# EAGLE design infnoise_edgecon (EAGLE 7.1.0)
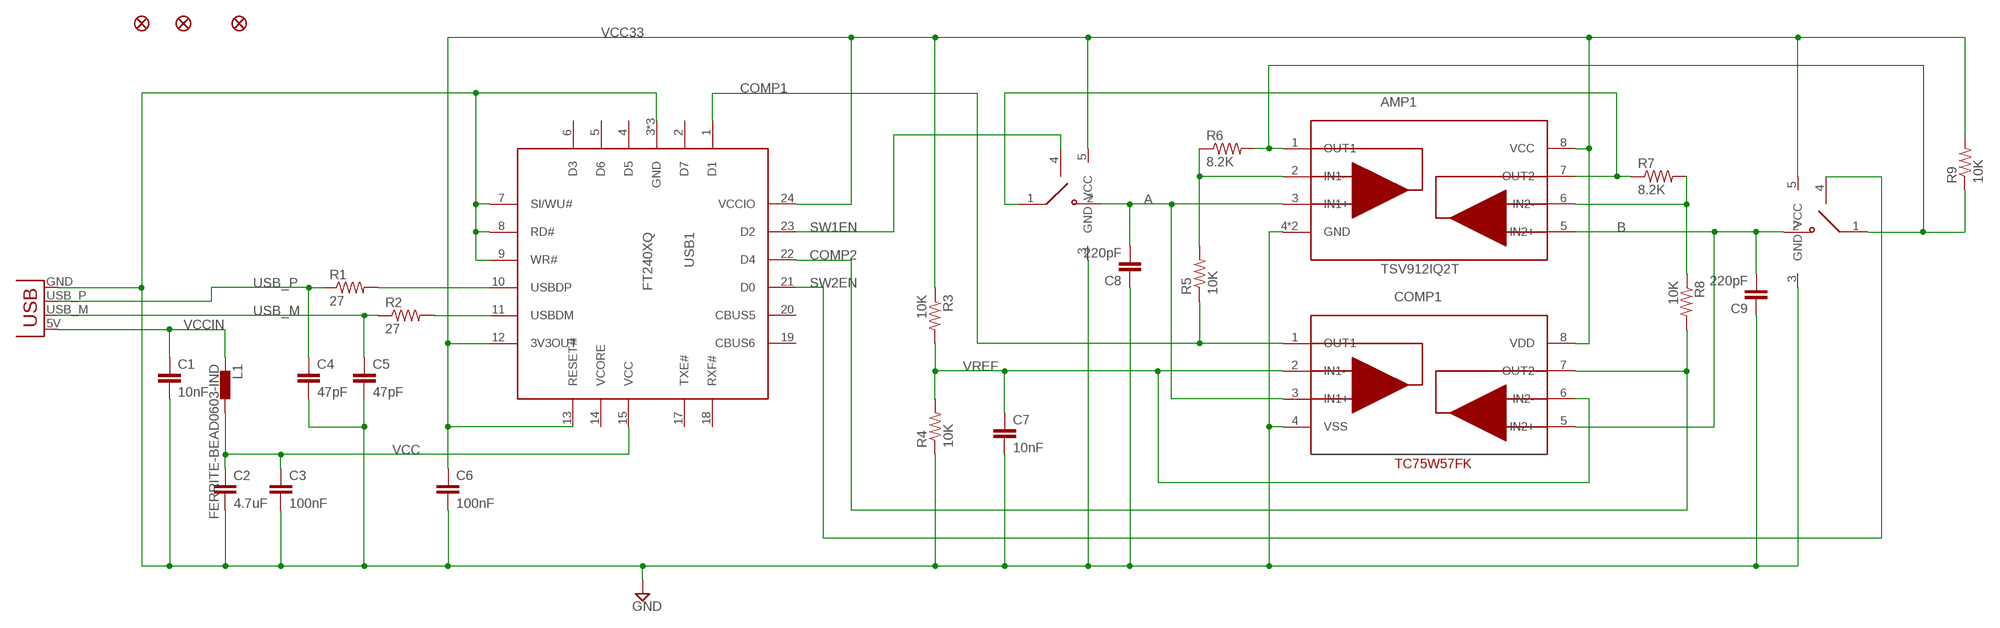
[diagram p0: schematic, sheet 1]

## Parts
AMP1  TSV912IQ2T  [DFN8-2X3]
C1  10nF  CAP0603-CAP  [0603-CAP]
C2  4.7uF  CAP0603-CAP  [0603-CAP]
C3  100nF  CAP0603-CAP  [0603-CAP]
C4  47pF  CAP0603-CAP  [0603-CAP]
C5  47pF  CAP0603-CAP  [0603-CAP]
C6  100nF  CAP0603-CAP  [0603-CAP]
C7  10nF  CAP0603-CAP  [0603-CAP]
C8  220pF  CAP0603-CAP  [0603-CAP]
C9  220pF  CAP0603-CAP  [0603-CAP]
COMP1  TC75W57FK  [SSOP8-P-0.50A]
FID1  FIDUCIALUFIDUCIAL  [MICRO-FIDUCIAL]
FID2  FIDUCIALUFIDUCIAL  [MICRO-FIDUCIAL]
FID3  FIDUCIALUFIDUCIAL  [MICRO-FIDUCIAL]
L1  FERRITE-BEAD0603-IND  [0603-IND]
R1  27  RESISTOR0603-RES  [0603-RES]
R2  27  RESISTOR0603-RES  [0603-RES]
R3  10K  RESISTOR0603-RES  [0603-RES]
R4  10K  RESISTOR0603-RES  [0603-RES]
R5  10K  RESISTOR0603-RES  [0603-RES]
R6  8.2K  RESISTOR0603-RES  [0603-RES]
R7  8.2K  RESISTOR0603-RES  [0603-RES]
R8  10K  RESISTOR0603-RES  [0603-RES]
R9  10K  RESISTOR0603-RES  [0603-RES]
SW1  MC74VHC1G66DFT1G  [SC70-5L]
SW2  MC74VHC1G66DFT1G  [SC70-5L]
USB1  FT240XQ  [QFN24-4X4]
X1  USB  [USB-A-PCB]

## Nets
A: AMP1.3(IN1+) C8.2 COMP1.3(IN1+) SW1.2(NO)
AMP1OUT: AMP1.1(OUT1) R6.2 R9.1 SW2.1(COM)
AMP2OUT: AMP1.7(OUT2) R7.1 SW1.1(COM)
B: AMP1.5(IN2+) C9.2 COMP1.5(IN2+) SW2.2(NO)
COMP1: COMP1.1(OUT1) R5.1 USB1.1(D1)
COMP2: COMP1.7(OUT2) R8.2 USB1.22(D4)
FB1: AMP1.2(IN1-) R5.2 R6.1
FB2: AMP1.6(IN2-) R7.2 R8.1
GND: AMP1.4(GND) AMP1.EXP(GND) C1.2 C2.2 C3.2 C4.2 C5.2 C6.2 C7.2 C8.1 C9.1 COMP1.4(VSS) R4.1 SW1.3(GND) SW2.3(GND) USB1.3(GND) USB1.7(SI/WU#) USB1.8(RD#) USB1.9(WR#) USB1.16(GND) USB1.EXP(GND) X1.GND
N$2: R1.2 USB1.10(USBDP)
SW1EN: SW1.4(IN) USB1.23(D2)
SW2EN: SW2.4(IN) USB1.21(D0)
USB_M: C5.1 R2.1 X1.USB_M(D-)
USB_P: C4.1 R1.1 X1.USB_P(D+)
USBDM: R2.2 USB1.11(USBDM)
VCC: C2.1 C3.1 L1.2 USB1.15(VCC)
VCC33: AMP1.8(VCC) C6.1 COMP1.8(VDD) R3.1 R9.2 SW1.5(VCC) SW2.5(VCC) USB1.12(3V3OUT) USB1.13(RESET#) USB1.24(VCCIO)
VCCIN: C1.1 L1.1 X1.5V(VCC)
VREF: C7.1 COMP1.2(IN1-) COMP1.6(IN2-) R3.2 R4.2
Unconnected: USB1.2(D7) USB1.4(D5) USB1.5(D6) USB1.6(D3) USB1.14(VCORE) USB1.17(TXE#) USB1.18(RXF#) USB1.19(CBUS6) USB1.20(CBUS5)

## Library data of the parts
AMP1 = infnoise:TSV912: Cheap dual op-amp, rail-to-rail
C1-C9 = infnoise:CAP: Capacitor Standard 0603 ceramic capacitor, and 0.1" leaded capacitor.
COMP1 = infnoise:TC75W57: Dual comparator
FID1-FID3 = SparkFun-Aesthetics:FIDUCIAL: Fiducial Alignment Points Various fiducial points for machine vision alignment.
L1 = infnoise:FERRITE-BEAD: Chip Ferrite Bead for GHz Noise
R1-R9 = infnoise:RESISTOR: Resistor Basic schematic elements and footprints for 0603, 1206, and PTH resistors.
SW1 SW2 = infnoise:MC74VHC1G66: SPST (NO) Normally Open Analog Switch
USB1 = infnoise:FT240X: USB to FIFO interface chip
X1 = infnoise:USB: USB Connectors

## Board
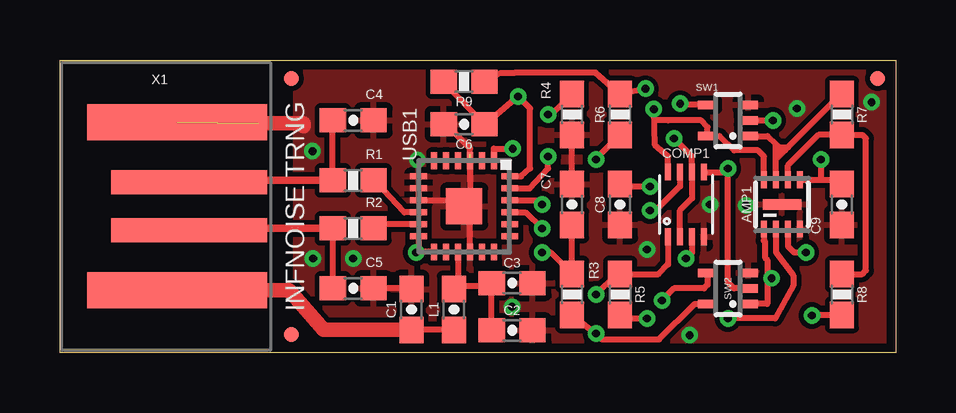
[diagram p1: board, top side]
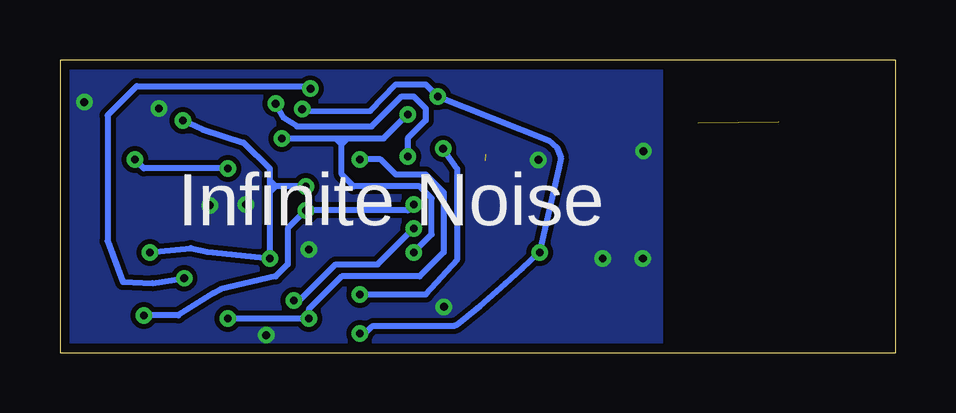
[diagram p2: board, bottom side, seen from below]

Size 34.85 x 12.19 mm. Coordinates in mm from the lower left corner, seen from the top.
Outline: 0,0 0,12.19 34.85,12.19 34.85,0 0,0
Copper layers (1*16): Top 0.0356mm / dielectric 1.5011mm / Bottom 0.0356mm
Design rules "default *": minimum track width 8mil, minimum drill 13mil, track to track 8mil, track to pad 8mil, pad to pad 8mil, via to via 8mil, smd to smd 8mil, copper to edge 15mil, drill to drill 8mil, minimum pad ring 7mil, minimum via ring 7mil, stop-mask expansion 25mil, vias tented up to drill 14mil, thermal gap 10mil

### Footprints (pad centres in the part's own frame; a part is rotated, then mirrored left to right if it is on the bottom)
DFN8-2X3 = smd 0.25 x 0.7: 1 -0.75,-1.025; 2 -0.25,-1.025; 3 0.25,-1.025; 4 0.75,-1.025; 5 0.75,1.025; 6 0.25,1.025; 7 -0.25,1.025; 8 -0.75,1.025 | smd 1.6 x 0.45: EXP 0,0
0603-CAP = smd 1.1 x 1: 1 -0.85,0; 2 0.85,0
SSOP8-P-0.50A = smd 0.25 x 0.7: 1 -0.75,-1.35; 2 -0.25,-1.35; 3 0.25,-1.35; 4 0.75,-1.35; 5 0.75,1.35; 6 0.25,1.35; 7 -0.25,1.35; 8 -0.75,1.35
MICRO-FIDUCIAL = smd 0.635 x 0.635: 1 0,0
0603-IND = smd 1.1 x 1: 1 -0.85,0; 2 0.85,0
0603-RES = smd 1.1 x 1: 1 -0.85,0; 2 0.85,0
SC70-5L = smd 0.35 x 0.8: 1 -0.65,-0.85; 2 0,-0.85; 3 0.65,-0.85; 4 0.65,0.85; 5 -0.65,0.85
QFN24-4X4 = smd 0.7 x 0.25: 1 -1.9,1.25; 2 -1.9,0.75; 3 -1.9,0.25; 4 -1.9,-0.25; 5 -1.9,-0.75; 6 -1.9,-1.25; 13 1.9,-1.25; 14 1.9,-0.75; 15 1.9,-0.25; 16 1.9,0.25; 17 1.9,0.75; 18 1.9,1.25 | smd 0.25 x 0.7: 7 -1.25,-1.9; 8 -0.75,-1.9; 9 -0.25,-1.9; 10 0.25,-1.9; 11 0.75,-1.9; 12 1.25,-1.9; 19 1.25,1.9; 20 0.75,1.9; 21 0.25,1.9; 22 -0.25,1.9; 23 -0.75,1.9; 24 -1.25,1.9 | smd 1.5 x 1.5: EXP 0,0
USB-A-PCB = smd 7.5 x 1.5: 5V -0.2,-3.5; GND -0.2,3.5 | smd 6.5 x 1: USB_M 0.3,-1; USB_P 0.3,1

### Placement (x,y rotation side)
AMP1  30.1,6.17 0 top
C1  14.65,1.8 90 top
C2  18.85,0.92 0 top
C3  18.85,2.9 0 top
C4  12.22,9.67 0 top
C5  12.22,2.67 0 top
C6  16.85,9.52 180 top
C7  21.35,6.17 90 top
C8  23.35,6.17 90 top
C9  32.6,6.17 90 top
COMP1  26.1,6.17 0 top
FID1  9.65,0.76 0 top
FID2  9.65,11.43 0 top
FID3  34.09,11.43 0 top
L1  16.42,1.8 90 top
R1  12.22,7.17 0 top
R2  12.22,5.17 0 top
R3  21.35,2.42 90 top
R4  21.35,9.92 90 top
R5  23.35,2.42 270 top
R6  23.35,9.92 90 top
R7  32.6,9.92 270 top
R8  32.6,2.42 270 top
R9  16.85,11.3 180 top
SW1  27.85,9.67 90 top
SW2  27.85,2.67 90 top
USB1  16.85,6.1 270 top
X1  5.08,6.1 0 top

### Tracks (layer width: path | path; a pad name or v marks a point on that pad's centre or on a via)
A  (via drill 0.33)
  Top 0.254: AMP1.3 30.35,4.42 30.6,4.17 v31.1,4.17 | SW1.2 v29.72,9.67 | COMP1.3 26.35,4.17 v26.1,3.92 | C8.2 23.45,6.92 v24.6,6.92
  Bottom 0.254: v29.72,9.67 28.93,9.31 27.2,8.75 26.1,7.67 26.1,7.17 | 26.1,7.17 26.1,6.92 | 26.1,6.92 26.1,6.67 | 26.1,6.67 v26.1,3.92 28.7,4.2 29.38,4.35 v31.1,4.17 | v24.6,6.92 25.85,6.92 | 25.85,6.92 26.1,6.92 | 25.85,6.92 26.1,7.17 | 25.85,6.92 26.1,6.67
AMP1OUT  (via drill 0.33)
  Top 0.254: R9.1 18.37,11.65 18.97,11.67 22.32,11.67 R6.2 23.47,10.82 v24.41,11 | 29.49,3.1 29.49,3.86 29.39,3.96 29.39,4.62 29.34,4.67 29.34,5.13 AMP1.1 | 29.49,3.1 29.49,2.03 28.7,2.03 SW2.1 | v29.67,3.1 29.49,3.1
  Bottom 0.254: v29.67,3.1 30.99,2.9 32.23,2.95 32.87,4.65 32.87,9.88 31.65,11.1 24.41,11.1 v24.41,11
AMP2OUT
  Top 0.254: AMP1.7 29.85,8.05 | 29.85,8.05 29.85,8.17 | 29.85,8.17 29.85,8.42 | 29.85,8.42 29.85,8.67 | 30.35,8.55 32.6,10.8 R7.1 | 30.35,8.55 30.22,8.42 | SW1.1 29.5,9.02 29.85,8.67 | 30.22,8.42 30.1,8.42 | 30.1,8.42 29.85,8.42 | 29.85,8.67 29.97,8.55 | 29.97,8.55 30.1,8.42 | 30.1,8.42 29.85,8.17 | 30.22,8.42 29.85,8.05 | 29.97,8.55 30.35,8.55
B  (via drill 0.33)
  Top 0.254: AMP1.5 31.72,7.2 | 31.72,7.2 32.42,7.2 C9.2 | COMP1.5 27.7,7.52 v27.85,7.67 27.85,2.92 28.1,2.67 SW2.2 | v31.72,8.05 31.72,7.2
  Bottom 0.254: v27.85,7.67 31.35,7.67 v31.72,8.05
COMP1  (via drill 0.33)
  Top 0.254: COMP1.1 25.35,3.67 24.95,3.27 R5.1 23.2,3.27 v22.35,2.42 | USB1.1 18.09,8.5 v18.87,8.5
  Bottom 0.254: v22.35,2.42 19.6,2.42 18.28,3.9 18.28,7.65 v18.87,8.5
COMP2  (via drill 0.33)
  Top 0.254: COMP1.7 25.85,6.92 24.85,5.92 v24.6,5.92 | USB1.22 19.85,6.35 v20.1,6.17 | R8.2 32.57,1.55 v31.35,1.55
  Bottom 0.254: v20.1,6.17 20.35,5.92 v24.6,5.92 25.35,5.17 25.35,3.67 25.85,3.17 28.17,2.64 28.42,2.49 29.92,1.55 v31.34,1.55 v31.35,1.55
FB1  (via drill 0.33)
  Top 0.254: AMP1.2 29.85,4.17 30.57,3.22 30.57,2.78 29.82,1.42 v27.85,1.42 | R6.1 22.45,8.17 v22.35,8.05 | R5.2 23.62,1.42 v24.47,1.42
  Bottom 0.254: v22.35,8.05 21.47,8.05 20.85,7.42 19.6,7.42 18.85,6.67 18.85,4.17 19.85,3.17 23.1,3.17 24.47,1.8 v24.47,1.42 v27.85,1.42
FB2
  Top 0.254: AMP1.6 30.35,7.8 31.62,9.07 R7.2 33.45,9.07 33.6,8.92 33.6,3.42 33.45,3.27 R8.1
GND  (via drill 0.33)  (2 unrouted)
  Top 0.254: USB1.16 17.1,5.92 USB1.EXP | USB1.3 17.1,6.42 USB1.EXP | C7.2 R4.1 | C1.2 14.45,2.67 C5.2 | USB1.EXP 16.7,6.35 USB1.9 14.96,6.45 14.96,6.83 USB1.8 | 17.09,8.26 17.09,8.51 16.41,9.2
  Top 0.61: 8.26,9.55 10.16,9.55 10.16,9.42
  other vias: 10.55,3.92 10.53,8.4 27.1,6.17 24.47,4.3 30.72,10.17 26.25,0.72 14.91,8.03 28.6,6.14 12.22,3.92 18.85,1.91 33.83,10.44
  pour Bottom: 9.83,12.36 9.83,-0.12 34.85,-0.07 34.85,12.41
  pour Top: 9.83,12.41 9.83,-0.07 34.85,-0.07 34.85,12.41
N$2
  Top 0.254: USB1.10 14.35,5.85 13.2,7.07 R1.2
SW1EN  (via drill 0.33)
  Top 0.254: USB1.23 19.57,6.85 20.35,7.67 v20.35,8.17 | SW1.4 25.98,10.32 v25.85,10.37
  Bottom 0.254: v20.35,8.17 20.35,8.92 19.6,9.67 19.6,10.17 20.1,10.67 20.6,10.67 21.85,9.42 24.97,9.42 25.5,9.77 v25.85,10.37
SW2EN  (via drill 0.33)
  Top 0.254: USB1.21 19.4,5.85 v20.1,5.17 | SW2.4 27,2.82 26.85,2.67 25.6,2.67 v25.1,2.17
  Bottom 0.254: v25.1,2.17 24.85,2.17 23.35,3.67 21.6,3.67 v20.1,5.17
USB_M
  Top 0.254: R2.1 C5.1
  Top 0.305: X1.USB_M 5.46,5.17 R2.1
USB_P
  Top 0.254: R1.1 C4.1
  Top 0.305: X1.USB_P 5.46,7.17 R1.1
  Top 0.762: 11.47,7.2 R1.1
USBDM
  Top 0.254: USB1.11 13.42,5.35 R2.2
VCC
  Top 0.254: C2.1 C3.1 17.65,2.77 16.6,2.77 | 16.6,2.77 L1.2 | USB1.15 16.6,2.77
VCC33  (via drill 0.33)
  Top 0.254: R9.2 C6.1 18.09,9.83 v19.1,10.67 19.6,10.17 19.6,7.67 19.22,7.35 USB1.24 | USB1.12 14.95,4.2 | USB1.13 14.95,4.2 | 14.95,4.2 v14.85,4.17 | AMP1.8 29.35,8.17 29.1,8.42 28.1,8.42 27.5,9.02 SW1.5 27,9.4 26.72,9.67 25.35,9.67 24.77,9.69 v24.75,10.15 24.8,8.64 25.35,8.17 COMP1.8 | SW2.5 26.45,2.02 24.97,0.55 22.6,0.55 v22.35,0.8 22.2,0.9 R3.1
  Bottom 0.254: v24.75,10.15 24.61,10.05 21.92,10.07 20.85,11.17 19.6,11.17 v19.1,10.67 14.48,8.84 14.12,8.53 13.97,8.13 14.05,7.72 v14.85,4.17 15.59,3.5 16.28,2.87 17.35,1.93 17.45,1.85 18.31,1.14 18.41,1.12 21.79,1.12 21.89,1.04 22.12,0.81 22.33,0.81 v22.35,0.8
VCCIN
  Top 0.254: L1.1 C1.1
  Top 0.61: X1.5V 9.54,2.6 10.99,0.95 C1.1
VREF  (via drill 0.33)
  Top 0.254: C7.1 R3.2 20.45,4.17 v20.1,4.17 | v25.6,8.92 26.35,8.17 COMP1.6 26.35,6.42 25.85,5.92 COMP1.2 | R4.2 20.5,9.92 v20.35,9.92
  Bottom 0.254: v20.1,4.17 19.35,4.92 19.35,6.42 19.85,6.92 22.6,6.92 23.1,7.42 23.1,8.67 | v25.6,8.92 23.35,8.92 | 23.35,8.92 23.1,8.92 | 23.1,8.92 22.85,8.92 | 22.85,8.92 21.35,8.92 v20.35,9.92 | 23.1,8.67 23.1,8.92 | 23.1,8.67 23.35,8.92 | 23.1,8.67 22.85,8.92

### Text on the board
tNames: INFNOISE TRNG
bNames: Infinite Noise